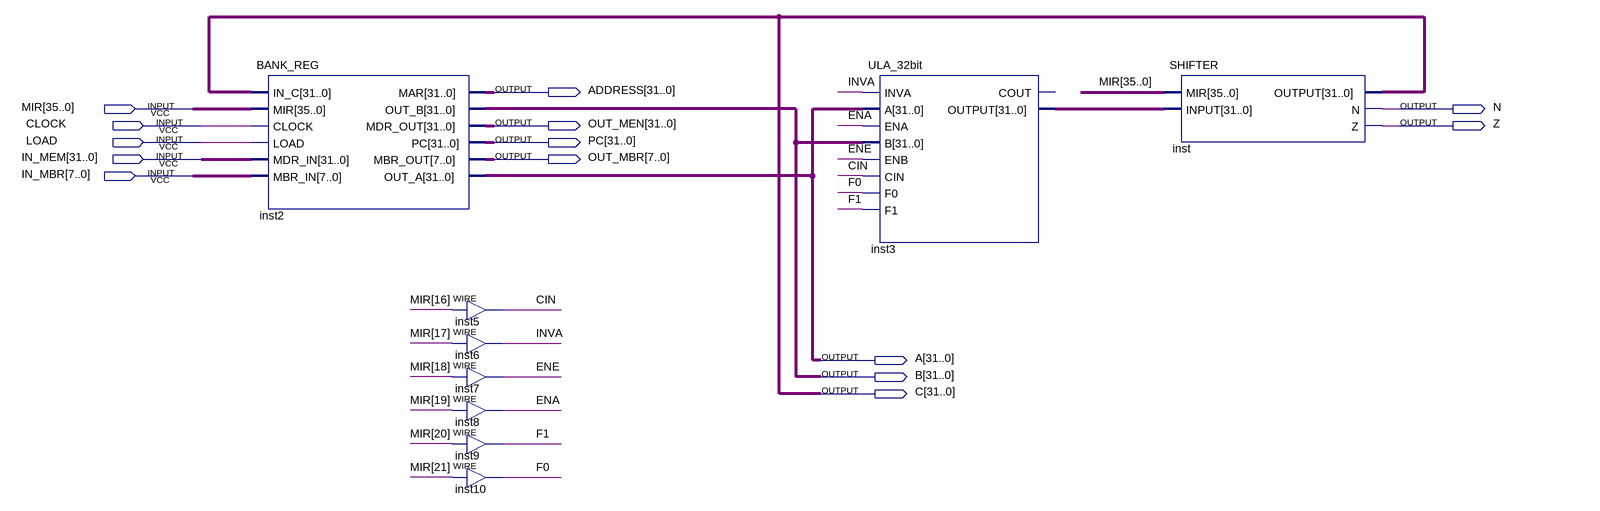
[diagram p0: schematic sheet]
// Quartus schematic data_path.bdf as structural Verilog: 9 symbols, 14 pins
module data_path (
  input  [35:0] MIR,
  input  CLOCK,
  input  LOAD,
  input  [31:0] IN_MEM,
  input  [7:0] IN_MBR,
  output [31:0] ADDRESS,
  output N,
  output [31:0] OUT_MEN,
  output Z,
  output [31:0] PC,
  output [7:0] OUT_MBR,
  output [31:0] A,
  output [31:0] B,
  output [31:0] C
);

  wire CIN, ENA, ENE, F0, F1, INVA;
  wire [31:0] inst3_output;

  BANK_REG inst2 (
    .IN_C(C), .MIR(MIR), .CLOCK(CLOCK), .LOAD(LOAD), .MDR_IN(IN_MEM), .MBR_IN(IN_MBR), .MAR(ADDRESS),
    .OUT_B(B), .MDR_OUT(OUT_MEN), .PC(PC), .MBR_OUT(OUT_MBR), .OUT_A(A));
  assign CIN = MIR[16];  // WIRE inst5
  assign INVA = MIR[17];  // WIRE inst6
  assign ENE = MIR[18];  // WIRE inst7
  assign ENA = MIR[19];  // WIRE inst8
  assign F1 = MIR[20];  // WIRE inst9
  assign F0 = MIR[21];  // WIRE inst10
  ULA_32bit inst3 (
    .INVA(INVA), .A(A), .ENA(ENA), .B(B), .ENB(ENE), .CIN(CIN), .F0(F0), .F1(F1), .OUTPUT(inst3_output));  // open: COUT
  SHIFTER inst (.MIR(MIR), .INPUT(inst3_output), .OUTPUT(C), .N(N), .Z(Z));
endmodule
